# EasyEDA Pro project 搞机小队_v1.1.3.eprj, schematic 主控
Board Name: 主控; Create Date: 2025-09-06; Page Name: P1; Project Name: 搞机小队_v1.1.3; Schematic Name: 主控; Update Date: 2025-10-30; Company: 嘉立创EDA; Page Size: A4; Version: V1.0
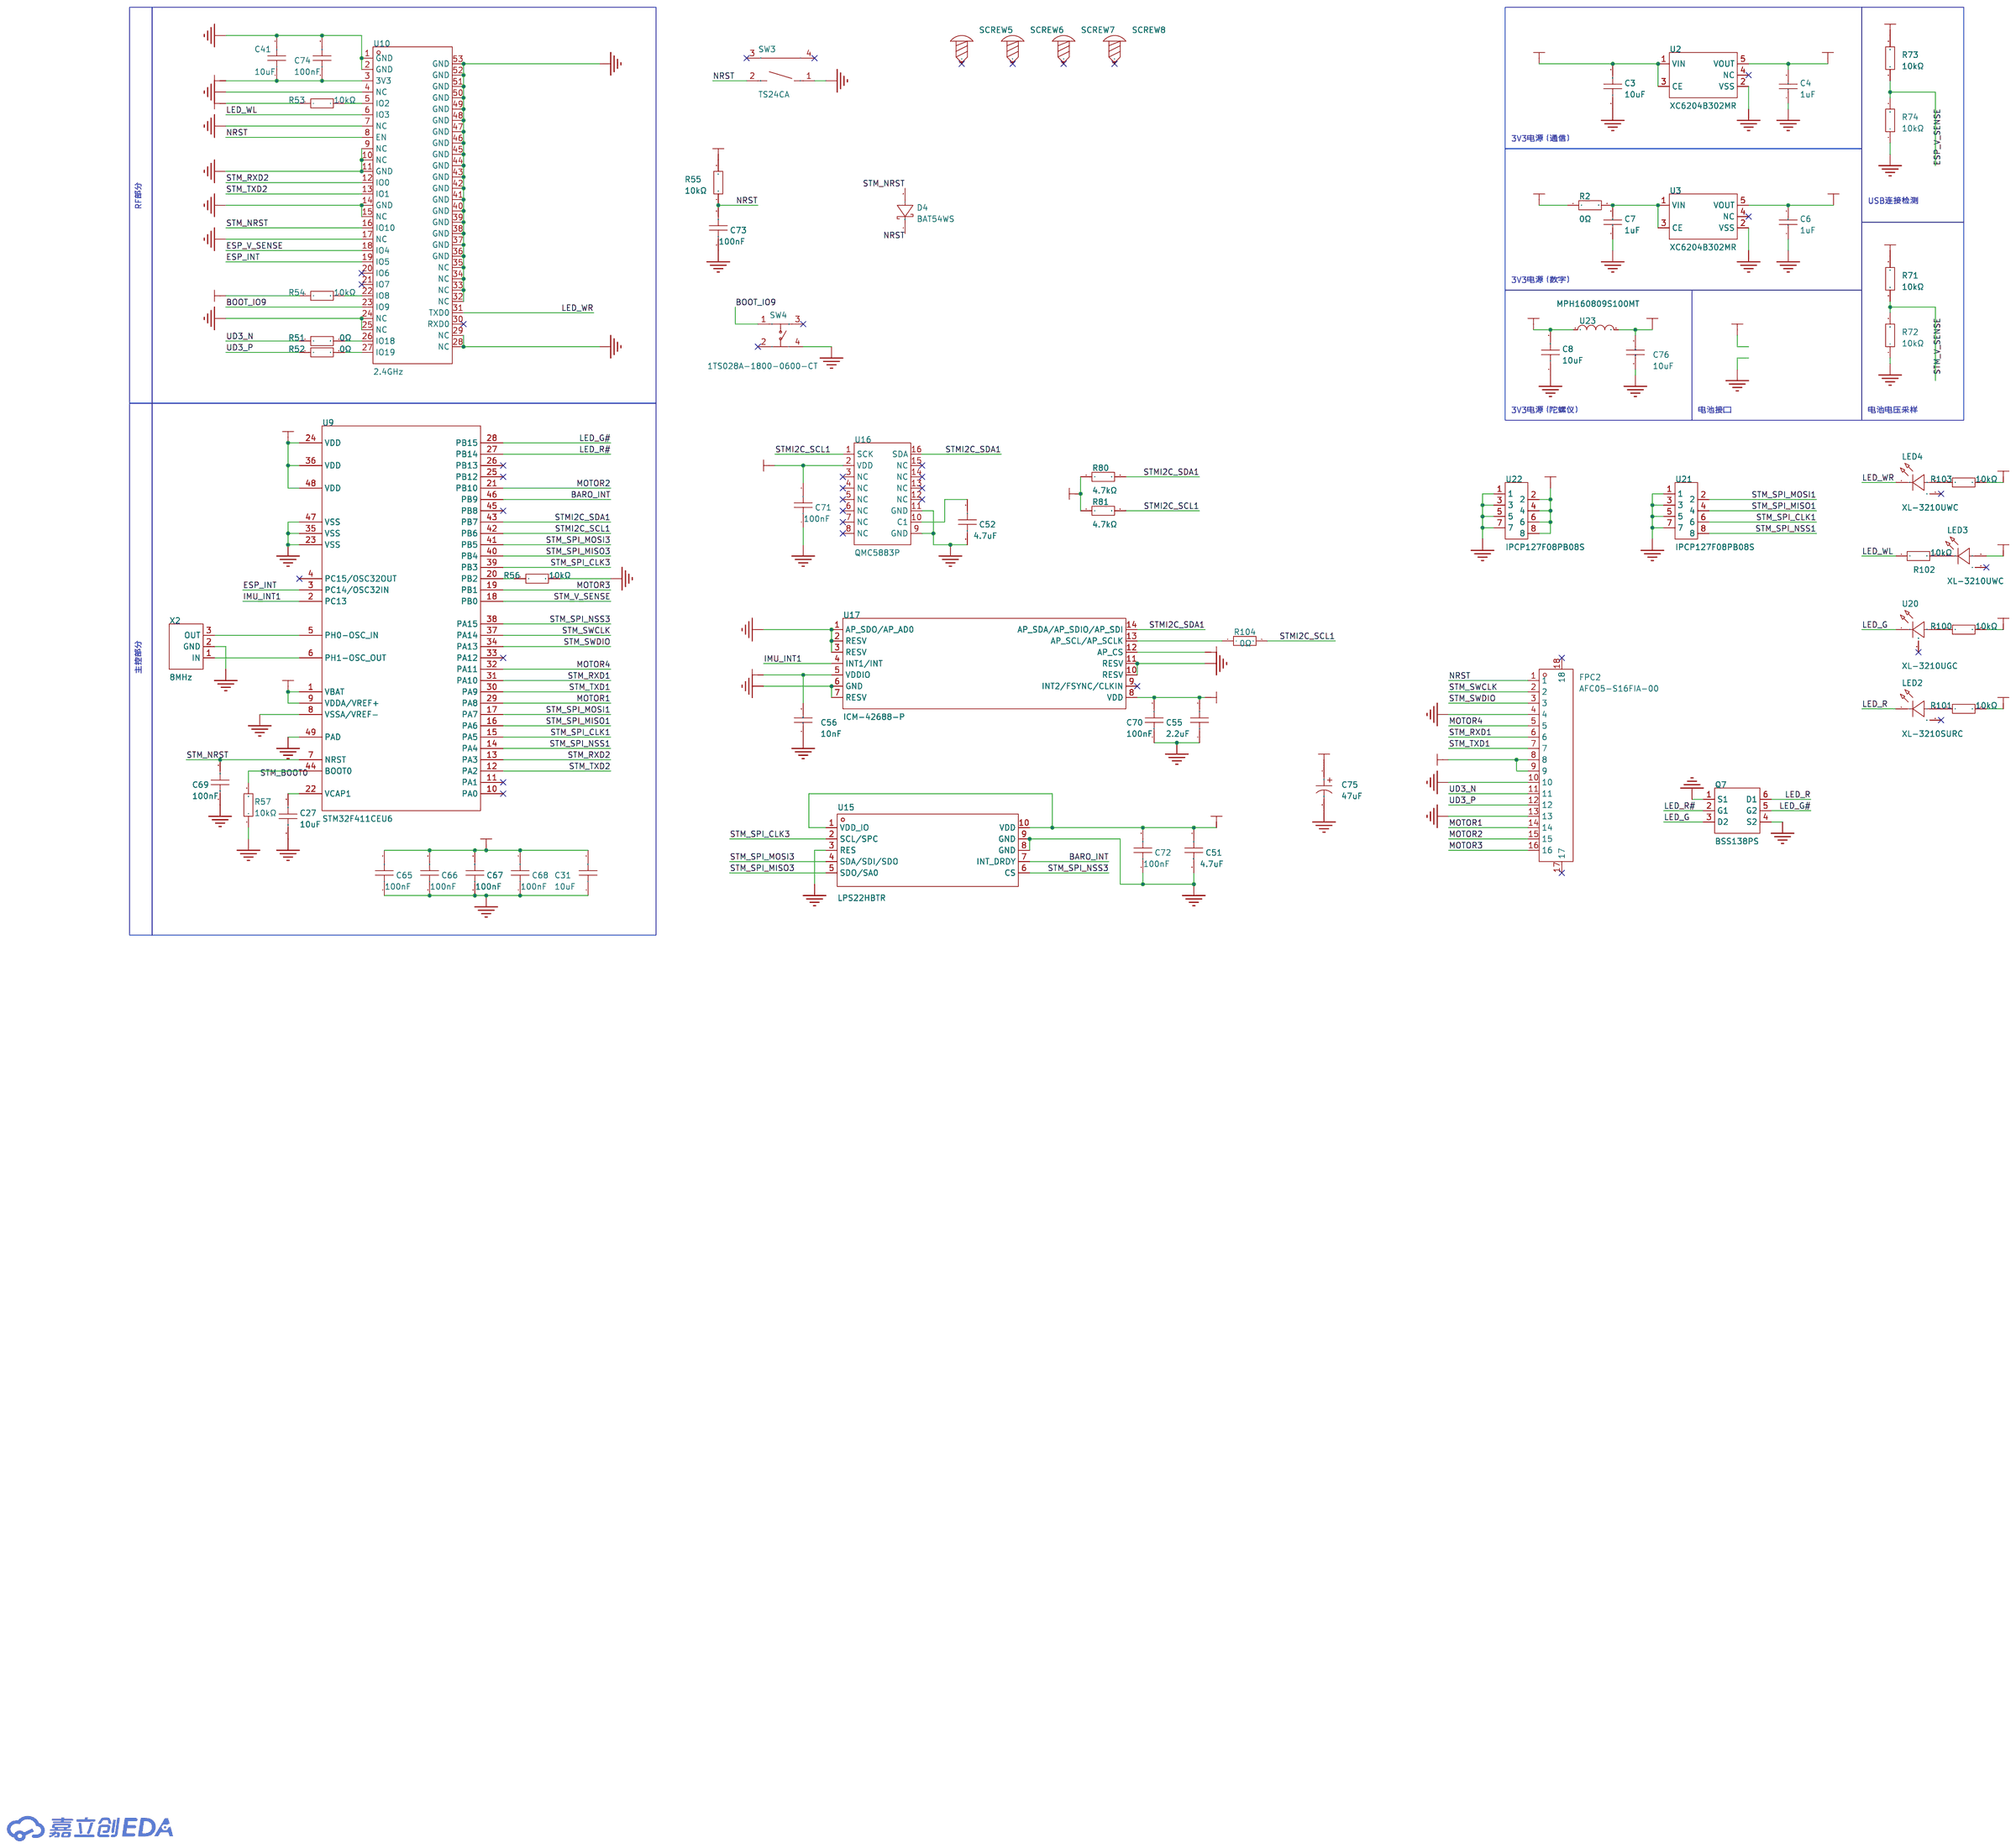
[diagram p0: schematic sheet]

## Parts
C3  10uF  [C0603]
C4  1uF  [C0603]
C6  1uF  [C0603]
C7  1uF  [C0603]
C8  10uF  [C0603]
C27  10uF  [C0603]
C31  10uF  [C0603]
C41  10uF  [C0603]
C51  4.7uF  [C0603]
C52  4.7uF  [C0603]
C55  2.2uF  [C0603]
C56  10nF  [C0603]
C65  100nF  [C0402]
C66  100nF  [C0402]
C67  100nF  [C0402]
C68  100nF  [C0402]
C69  100nF  [C0402]
C70  100nF  [C0402]
C71  100nF  [C0402]
C72  100nF  [C0402]
C73  100nF  [C0402]
C74  100nF  [C0402]
C75  47uF  [CAP-SMD_L3.2-W1.6]
C76  10uF  [C0603]
D4  BAT54WS  [SOD-323_L1.7-W1.3-LS2.6-RD]
FPC2  AFC05-S16FIA-00  [FPC-SMD_16P-P0.50_AFC05-S16FIA-00]
LED2  XL-3210SURC  [LED-SMD_3P-L3.2-W1.5-RD_EH-S110KGKT]
LED3  XL-3210UWC  [LED-SMD_3P-L3.2-W1.5-RD_ORANGE]
LED4  XL-3210UWC  [LED-SMD_3P-L3.2-W1.5-RD_ORANGE]
Q7  BSS138PS  [SOT-363_L2.1-W1.3-P0.65-LS2.3-BL]
R2  0Ω  [R0805]
R51  0Ω  [R0402]
R52  0Ω  [R0402]
R53  10kΩ  [R0402]
R54  10kΩ  [R0402]
R55  10kΩ  [R0402]
R56  10kΩ  [R0402]
R57  10kΩ  [R0402]
R71  10kΩ  [R0402]
R72  10kΩ  [R0402]
R73  10kΩ  [R0402]
R74  10kΩ  [R0402]
R80  4.7kΩ  [R0402]
R81  4.7kΩ  [R0402]
R100  10kΩ  [R0402]
R101  10kΩ  [R0402]
R102  10kΩ  [R0402]
R103  10kΩ  [R0402]
R104  0Ω  [R0603]
SCREW5  -  [M3螺丝]
SCREW6  -  [M3螺丝]
SCREW7  -  [M3螺丝]
SCREW8  -  [M3螺丝]
SW3  TS24CA  [SW-SMD_2P-TS24CA]
SW4  1TS028A-1800-0600-CT  [SW-SMD_4P-L2.8-W1.9-P1.20-LS3.0_1TS028A]
U2  XC6204B302MR  [SOT-23-5_L3.0-W1.7-P0.95-LS2.8-BL]
U3  XC6204B302MR  [SOT-23-5_L3.0-W1.7-P0.95-LS2.8-BL]
U9  STM32F411CEU6  [UFQFPN-48_L7.0-W7.0-P0.50-BL-EP]
U10  2.4GHz  [WIFIM-SMD_ESP32-C3-MINI-1]
U15  LPS22HBTR  [HLGA-10L_LPS22HBTR]
U16  QMC5883P  [LGA-16_L3.0-W3.0-P0.50-BL_SQ]
U17  ICM-42688-P  [LGA-14_L3.0-W2.5-P0.50-TL]
U20  XL-3210UGC  [LED-SMD_3P-L3.2-W1.5-RD_GREEN]
U21  IPCP127F08PB08S  [HDR-SMD_IPCP127F08PB08S]
U22  IPCP127F08PB08S  [HDR-SMD_IPCP127F08PB08S]
U23  MPH160809S100MT  [L0603]
X2  8MHz  [OSC-SMD_3P-L3.2-W1.3-P1.20]

## Library data of the parts
C3 C8 C27 C31 C41 = CC0603KRX5R6BB106: 容值:10uF;精度:±10%;额定电压:10V;材质(温度系数):X5R;; LCSC Part Name: 10uF ±10% 10V; Supplier Part: C326057; Manufacturer: YAGEO(国巨); Supplier Footprint: 0603; JLCPCB Part Class: 扩展库; Datasheet: https://atta.szlcsc.com/upload/public/pdf/source/20181031/C326057_4190003E428C5A97DF6434D0EAB53BEA.pdf; Supplier: LCSC; Tolerance: ±10%; Voltage Rated: 10V; Temperature Coefficient: X5R
C4 C6 C7 = CC0603KRX7R9BB105: 容值:1uF;精度:±10%;额定电压:50V;温度系数:X7R;; LCSC Part Name: 1uF ±10% 50V; Supplier Part: C559769; Manufacturer: YAGEO(国巨); Supplier Footprint: 0603; JLCPCB Part Class: Extended Part; Datasheet: https://item.szlcsc.com/datasheet/CC0603KRX7R9BB105/584032.html; Supplier: LCSC; Tolerance: ±10%; Voltage Rating: 50V; Temperature Coefficient: X7R
C51 C52 = CC0603KRX5R7BB475: 容值:4.7uF;精度:±10%;额定电压:16V;材质(温度系数):X5R;; LCSC Part Name: 4.7uF ±10% 16V; Supplier Part: C277476; Manufacturer: YAGEO(国巨); Supplier Footprint: 0603; JLCPCB Part Class: 扩展库; Datasheet: https://atta.szlcsc.com/upload/public/pdf/source/20240708/74D7CC2672B7CD71C30ED4CACAE97037.pdf; Supplier: LCSC; Tolerance: ±10%; Voltage Rated: 16V; Temperature Coefficient: X5R
C55 = CC0603KRX7R7BB225: 容值:2.2uF;精度:±10%;额定电压:16V;材质(温度系数):X7R;; LCSC Part Name: 2.2uF ±10% 16V; Supplier Part: C914769; Manufacturer: YAGEO(国巨); Supplier Footprint: 0603; Datasheet: https://atta.szlcsc.com/upload/public/pdf/source/20201217/C914769_172E140EC7E52AC241E5EC40E74BC1D4.pdf; Supplier: LCSC; Tolerance: ±10%; Voltage Rated: 16V; Temperature Coefficient: X7R
C56 = CC0603KRX7R9BB103: 容值:10nF;精度:±10%;额定电压:50V;材质(温度系数):X7R;; LCSC Part Name: 10nF ±10% 50V; Supplier Part: C100042; Manufacturer: YAGEO(国巨); Supplier Footprint: 0603; JLCPCB Part Class: 扩展库; Datasheet: https://atta.szlcsc.com/upload/public/pdf/source/20181008/C309510_22F155564471FAF6A489F7D68F34234E.pdf; Supplier: LCSC; Tolerance: ±10%; Voltage Rated: 50V; Temperature Coefficient: X7R
C65-C74 = CC0402KRX7R7BB104: 容值:100nF;精度:±10%;额定电压:16V;材质(温度系数):X7R;; LCSC Part Name: 100nF ±10% 16V; Supplier Part: C60474; Manufacturer: YAGEO(国巨); Supplier Footprint: 0402; Datasheet: https://atta.szlcsc.com/upload/public/pdf/source/20211223/9278FD768280B81DDBEF48FA36411A03.pdf; Supplier: LCSC; Tolerance: ±10%; Voltage Rated: 16V; Temperature Coefficient: X7R
C75 = CA45-A-10V-47uF-M: LCSC Part Name: 47uF ±20% 10V; Supplier Part: C688949; Manufacturer: CEC(振华新云); Supplier Footprint: CASE-A-3216; Datasheet: https://atta.szlcsc.com/upload/public/pdf/source/20200701/C688947_CFA6E56082A981E438B337581FD21AD9.pdf; Supplier: LCSC; Tolerance: ±20%; Rated Voltage: 10V; Equivalent Series Resistance(ESR): 4Ω@100kHz; Operating Temperature: -55℃~+125℃
C76 = CC0603MRX5R7BB106: LCSC Part Name: 10uF ±20% 16V; Supplier Part: C109457; Manufacturer: YAGEO(国巨); Supplier Footprint: 0603; JLCPCB Part Class: 扩展库; Datasheet: https://item.szlcsc.com/datasheet/CC0603MRX5R7BB106/110678.html; Supplier: LCSC; Tolerance: ±20%; Voltage Rating: 16V; Temperature Coefficient: X5R
D4 = BAT54WS_C5766570: 这款肖特基二极管具有0.2A的额定电流和30V的最大电压，其低正向压降仅为0.8V，在轻负载条件下反向电流低至2µA。该二极管能够承受高达0.6A的瞬态浪涌电流，适用于各种便携式电子产品中的高效整流或保护电路，确保设备稳定运行的同时减少能量损耗。(BAT54WS-7-F); LCSC Part Name: IF:0.2A VR:30V VF:0.8V IFSM:0.6A; Supplier Part: C5766570; Manufacturer: HXY MOSFET(华轩阳电子); Supplier Footprint: SOD-323; JLCPCB Part Class: 扩展库; Datasheet: https://atta.szlcsc.com/upload/public/pdf/source/20240930/6373992D0165080641439F83871EFB7A.pdf; Supplier: LCSC
FPC2 = AFC05-S16FIA-00: 锁定特性:翻盖式;触点类型:下接;触点数量:16P;间距:0.5mm;安装方式:卧贴;; LCSC Part Name: 间距:0.5mm P数:16P 翻盖式 下接; Supplier Part: C561388; Manufacturer: JS(钜硕电子); Supplier Footprint: SMD,P=0.5mm,卧贴; Datasheet: https://item.szlcsc.com/datasheet/AFC05-S16FIA-00/586775.html; Supplier: LCSC; Locking Feature: 翻盖式; Contact Type: 下接; Number of Contacts: 16P; Pitch: 0.5mm; Mounting Type: 卧贴; FFC, FCB Thickness: 0.3mm; Height Above Board: 1mm
LED2 = XL-3210SURC: LCSC Part Name: 贴片式发光二极管; Supplier Part: C965874; Manufacturer: XINGLIGHT(成兴光); Supplier Footprint: SMD,3.2x1.5mm; JLCPCB Part Class: Extended Part; Datasheet: https://item.szlcsc.com/datasheet/XL-3210SURC/1051483.html; Supplier: LCSC; Illumination Color: 红色; Voltage - Forward(Vf): 2.4V; Power(Watts): 50mW; Forward Current: 20mA; Wavelength - Dominant: 615nm~630nm; Peak Wavelength: 625nm; Lens Color: 无色透明透镜; Luminous Intensity: 300mcd; Viewing Angle: 120°; Mounting Style: 侧贴
LED3 LED4 = XL-3210UWC: 灯头类型:-;发光颜色:白色;正向压降(Vf):3.4V;功率:70mW;正向电流:20mA;波长:-;二极管配置:-;透镜颜色:黄色透镜;色温:-;发光强度:1100mcd;发光角度:120°;载带方式:侧贴;工作温度:-;; Supplier Part: C965880; Manufacturer: XINGLIGHT(成兴光); Supplier Footprint: SMD,1.5x3.2mm; JLCPCB Part Class: 扩展库; Datasheet: https://item.szlcsc.com/datasheet/XL-3210UWC/1051489.html; Supplier: LCSC; Illumination Color: 白色; Voltage - Forward(Vf): 3.4V; Power(Watts): 70mW; Forward Current: 20mA; Lens Color: 黄色透镜; Luminous Intensity: 1100mcd; Viewing Angle: 120°; Mounting Style: 侧贴
Q7 = BSS138PS_C5224289: 数量:2个N沟道;漏源电压(Vdss):60V;连续漏极电流(Id):410mA;导通电阻(RDS(on)):1.5Ω@10V；1.6Ω@4.5V;耗散功率(Pd):417mW;阈值电压(Vgs(th)):1V@250uA;; LCSC Part Name: 2个N沟道 耐压:60V 电流:410mA; Supplier Part: C5224289; Manufacturer: ElecSuper(静芯); Supplier Footprint: SOT-363; Datasheet: https://item.szlcsc.com/datasheet/BSS138PS/5925798.html; Supplier: LCSC; Number: 2个N沟道; Drain to Source Voltage: 60V; Current - Continuous Drain(Id): 410mA; RDS(on): 1.5Ω@10V；1.6Ω@4.5V; Pd - Power Dissipation: 417mW; Gate Threshold Voltage (Vgs(th)): 1V@250uA; Gate Charge(Qg): 650pC@4.5V; Input Capacitance(Ciss): 25pF; Reverse Transfer Capacitance (Crss@Vds): 2.2pF; Operating Temperature: -50℃~+150℃; Type: N沟道; Output Capacitance(Coss): 9.7pF
R2 = 0805W8F0000T5E: 电阻类型:厚膜电阻;阻值:0Ω;精度:±1%;功率:125mW;最大工作电压:150V;温度系数:±800ppm/℃;; LCSC Part Name: 0Ω ±1% 125mW 厚膜电阻; Supplier Part: C17477; Manufacturer: UNI-ROYAL(厚声); Supplier Footprint: 0805; Datasheet: https://atta.szlcsc.com/upload/public/pdf/source/20200306/C422600_1E6D84923E4A46A82E41ADD87F860B5C.pdf; Supplier: LCSC; Type: 厚膜电阻; Tolerance: ±1%; Power(Watts): 125mW; Overload Voltage (Max): 150V; Temperature Coefficient: ±800ppm/℃; Operating Temperature Range: -55℃~+155℃
R51 R52 = 0402WGF0000TCE: 电阻类型:厚膜电阻;阻值:0Ω;精度:±1%;功率:62.5mW;工作电压:50V;温度系数:±800ppm/℃;; LCSC Part Name: 0Ω ±1% 62.5mW 厚膜电阻; Supplier Part: C17168; Manufacturer: UNI-ROYAL(厚声); Supplier Footprint: 0402; JLCPCB Part Class: 基础库; Datasheet: https://item.szlcsc.com/datasheet/0402WGF0000TCE/17853.html; Supplier: LCSC; Type: 厚膜电阻; Tolerance: ±1%; Power(Watts): 62.5mW; Voltage-Supply(Max): 50V; Temperature Coefficient: ±800ppm/℃; Operating Temperature: -55℃~+155℃
R53-R57 R71-R74 R100-R103 = 0402WGF1002TCE: 电阻类型:厚膜电阻;阻值:10kΩ;精度:±1%;功率:62.5mW;工作电压:50V;温度系数:±100ppm/℃;; LCSC Part Name: 10kΩ ±1% 62.5mW 厚膜电阻; Supplier Part: C25744; Manufacturer: UNI-ROYAL(厚声); Supplier Footprint: 0402; JLCPCB Part Class: 基础库; Datasheet: https://item.szlcsc.com/datasheet/0402WGF1002TCE/26487.html; Supplier: LCSC; Type: 厚膜电阻; Tolerance: ±1%; Power(Watts): 62.5mW; Voltage-Supply(Max): 50V; Temperature Coefficient: ±100ppm/℃; Operating Temperature: -55℃~+155℃
R80 R81 = 0402WGF4701TCE: 电阻类型:厚膜电阻;阻值:4.7kΩ;精度:±1%;功率:62.5mW;工作电压:50V;温度系数:±100ppm/℃;; LCSC Part Name: 4.7kΩ ±1% 62.5mW 厚膜电阻; Supplier Part: C25900; Manufacturer: UNI-ROYAL(厚声); Supplier Footprint: 0402; JLCPCB Part Class: 基础库; Datasheet: https://item.szlcsc.com/datasheet/0402WGF4701TCE/26643.html; Supplier: LCSC; Type: 厚膜电阻; Tolerance: ±1%; Power(Watts): 62.5mW; Voltage-Supply(Max): 50V; Temperature Coefficient: ±100ppm/℃; Operating Temperature: -55℃~+155℃
R104 = 0603WAF0000T5E: 电阻类型:厚膜电阻;阻值:0Ω;精度:±1%;功率:100mW;工作电压:75V;温度系数:-;; LCSC Part Name: 0Ω ±1% 100mW 厚膜电阻; Supplier Part: C21189; Manufacturer: UNI-ROYAL(厚声); Supplier Footprint: 0603; Datasheet: https://item.szlcsc.com/datasheet/0603WAF0000T5E/21903.html; Supplier: LCSC; Type: 厚膜电阻; Tolerance: ±1%; Power(Watts): 100mW; Voltage-Supply(Max): 75V; Operating Temperature: -55℃~+155℃
SCREW5-SCREW8 = M3螺丝: Supplier Footprint: 插件; Check: false
SW3 = TS24CA: 电路结构:单刀单掷;按钮形状:矩形按钮;安装方式:卧贴;开关长度:4.55mm;开关宽度:1.8mm;开关高度:3.5mm;触点电流:50mA;额定电压:12V;带灯:-;工作寿命:-;; LCSC Part Name: 4.55*1.8*3.5mm 卧贴 轻触开关; Supplier Part: C393942; Manufacturer: SHOU HAN(首韩); Supplier Footprint: SMD; JLCPCB Part Class: 扩展库; Datasheet: https://item.szlcsc.com/datasheet/TS24CA/372554.html; Supplier: LCSC; Circuit: 单刀单掷; Actuator Style: 矩形按钮; Mounting Type: 卧贴; Length: 4.55mm; Width: 1.8mm; Switch Height: 3.5mm; Contact Current: 50mA; Voltage Rating: 12V
SW4 = 1TS028A-1800-0600-CT: 电路结构:单刀单掷;按钮形状:圆形按钮;作用力:180gf;安装方式:立贴;开关长度:2.8mm;开关宽度:1.9mm;开关高度:0.6mm;带支架:不带;触点电流:50mA;额定电压(DC):12V;额定功率:0.6W;绝缘电阻:100MΩ;带灯:无;机械寿命:30万次;; LCSC Part Name: 2.8*1.9*0.6mm 立贴 轻触开关; Supplier Part: C481988; Manufacturer: HYP(鸿源精密); Supplier Footprint: SMD,1.9x2.8mm; JLCPCB Part Class: 扩展库; Datasheet: https://atta.szlcsc.com/upload/public/pdf/source/20200113/C481988_727CCA1D3584FEA5100570402D465BF6.pdf; Supplier: LCSC; Circuit: 单刀单掷; Actuator Style: 圆形按钮; Operating Force: 180gf; Mounting Style: 立贴; Switch Length: 2.8mm; Switch Width: 1.9mm; Switch Height: 0.6mm; Strike Gundam: 不带; Contact Current: 50mA; Voltage Rating (DC): 12V; Power Rating: 0.6W; Insulation Resistance: 100MΩ; Actuator/Cap Color: 黑色; With Lamp: 无; IP Rating: IP68; Pin Style: SMD接片; Mechanical Life: 30万次; Operating Temperature: -40℃~+90℃
U2 U3 = XC6204B302MR: 输出类型:固定;工作电压:24V;输出电压:3V;输出电流:300mA;电源纹波抑制比(PSRR):-;输出极性:正极;; Supplier Part: C18212678; Manufacturer: TECH PUBLIC(台舟); Supplier Footprint: SOT-23-5; JLCPCB Part Class: 扩展库; Datasheet: https://atta.szlcsc.com/upload/public/pdf/source/20231024/3932E471DEDBF94F2F854F1C0B7D03E0.pdf; Supplier: LCSC; Output Type: 固定; Voltage - Supply: 24V; Output Voltage: 3V; Output Current: 300mA; Features: 过流保护；过热保护; Operating Temperature: -40℃~+125℃@(Tj); Output Configuration: 正极; Number of Outputs: 1
U9 = STM32F411CEU6: CPU内核:ARM-M4;CPU最大主频:100MHz;应用领域:-;; LCSC Part Name: 带DSP和FPU的高性能基本型系列ARM Cortex-M4 MCU，具有512 KB Flash、100 MHz CPU和ART加速器; Supplier Part: C60420; Manufacturer: ST(意法半导体); Supplier Footprint: UFQFPN-48(7x7); Datasheet: https://atta.szlcsc.com/upload/public/pdf/source/20151026/1457707507170.pdf; Supplier: LCSC; CPU Core: ARM-M4; CPU Maximum Speed: 100MHz; Program Storage Size: 512KB; Program Memory Type: FLASH; Number of I/O: 36; ADC (Bit): 12bit; Voltage - Supply: 1.7V~3.6V
U10 = ESP32-C3-MINI-1-H4: 核心处理器:-;频率:2.4GHz;天线形式:板载PCB天线;发射功率:20.5dBm;接收灵敏度:-96dBm;; Supplier Part: C2934569; Manufacturer: ESPRESSIF(乐鑫); Supplier Footprint: SMD,13.2x16.6mm; JLCPCB Part Class: 扩展库; Datasheet: https://atta.szlcsc.com/upload/public/pdf/source/20211222/4A6E563D9536B67D492463D36DD57C1D.pdf; Supplier: LCSC; Support Interface: SPI; Antenna Type: 板载PCB天线; Output Power: 20.5dBm; Operating Voltage: 3.3V; Sensitivity: -96dBm; Operating Temperature: -40℃~+85℃
U15 = LPS22HBTR: 压力范围:26Kpa~126Kpa;; Supplier Part: C94049; Manufacturer: ST(意法半导体); Supplier Footprint: HLGA-10(2x2); JLCPCB Part Class: 扩展库; Datasheet: https://atta.szlcsc.com/upload/public/pdf/source/20170908/C94049_1504870171328958154.pdf; Supplier: LCSC; Pressure range: 26Kpa~126Kpa; The Power Supply Voltage: 1.7V~3.6V; Operating Temperature: -40℃~+85℃
U16 = QMC5883P: QMC5883L停产，推荐使用 C2847467 QMC5883P替代; LCSC Part Name: 三轴磁传感器; Supplier Part: C2847467; Manufacturer: QST(上海矽睿); Supplier Footprint: LGA-16(3x3); JLCPCB Part Class: 扩展库; Datasheet: https://item.szlcsc.com/datasheet/QMC5883P/3044607.html; Supplier: LCSC
U17 = ICM-42688-P: 传感器类型:加速度计陀螺仪;; Supplier Part: C1850418; Manufacturer: TDK InvenSense(应美盛); Supplier Footprint: LGA-14(2.5x3); JLCPCB Part Class: 扩展库; Datasheet: https://atta.szlcsc.com/upload/public/pdf/source/20210703/CF24204867ACE5B754A2B035F23E5931.pdf; Supplier: LCSC; Sensor Type: 加速度计陀螺仪
U20 = XL-3210UGC: 发光颜色:翠绿色;功率:-;正向电流:-;波长:517.5nm~525nm;透镜颜色:无色透明透镜;色温:-;发光角度:120°;载带方式:侧贴;工作温度:-;; Supplier Part: C965877; Manufacturer: XINGLIGHT(成兴光); Supplier Footprint: SMD,1.5x3.2mm; Datasheet: https://item.szlcsc.com/datasheet/XL-3210UGC/1051486.html; Supplier: LCSC; Illumination Color: 翠绿色; Wavelength - Dominant: 517.5nm~525nm; Peak Wavelength: 535nm; Lens Color: 无色透明透镜; Viewing Angle: 120°; Mounting Style: 侧贴
U21 U22 = IPCP127F08PB08S: 插孔结构:1x8P;间距:1.27mm;圆孔/方孔:方孔;安装方式:立贴;排数:单排;总孔位数:8P;额定电流:1A;额定电压:-;塑高:2mm;触头材质:磷青铜;触头镀层:金;工作温度:-40℃~+105℃;; LCSC Part Name: 1x8P 间距:1.27mm 立贴; Supplier Part: C22438398; Manufacturer: INCP; Supplier Footprint: SMD,P=1.27mm(交错脚); Datasheet: https://item.szlcsc.com/datasheet/IPCP127F08PB08S/24076587.html; Supplier: LCSC; Holes Structure: 1x8P; Pitch: 1.27mm; Circular Hole / Square Hole: 方孔; Mounting Type: 立贴; Number of Rows: 单排; Number of Positions: 8P; Current Rating: 1A; Insulation Height: 2mm; Contact Material: 磷青铜; Contact Plating: 金; Operating Temperature: -40℃~+105℃
U23 = MPH160809S100MT: Supplier Part: C6807729; Manufacturer: Sunlord(顺络); Supplier Footprint: 0603; JLCPCB Part Class: 扩展库; Datasheet: https://atta.szlcsc.com/upload/public/pdf/source/20241120/D50FD5550E500CE51CF2F3A3AE14E46E.pdf; Supplier: LCSC
X2 = CSTNE8M00G520000R0: 频率:8MHz;内置负载电容:10pF;谐振阻抗:40Ω;; LCSC Part Name: 8MHz ±0.5% 内置负载电容:10pF; Supplier Part: C907975; Manufacturer: muRata(村田); Supplier Footprint: SMD3213-3P; JLCPCB Part Class: 扩展库; Datasheet: https://atta.szlcsc.com/upload/public/pdf/source/20201022/C907975_BE77A173E35C03920A12013DDB2B8858.pdf; Supplier: LCSC; Built-in Load Capacitance: 10pF; Resonant Impedance: 40Ω; Operating Temperature: -40℃~+85℃

## Nets
3V3_D: C6.2 C8.2 C31.2 C65.2 C66.2 C67.2 C68.2 U3.5(VOUT) U9.1(VBAT) U9.9(VDDA/VREF+) U9.24(VDD) U9.36(VDD) U9.48(VDD) U23.1
3V3_IMU: C51.1 C55.2 C56.2 C70.2 C71.2 C72.2 C76.2 R80.1 R81.1 U15.1(VDD_IO) U15.10(VDD) U16.2(VDD) U17.5(VDDIO) U17.8(VDD) U17.12(AP_CS) U23.2
3V3_RF: C4.2 C41.1 C74.1 LED3.2(A) R53.1 R54.1 R55.2 R103.2 U2.5(VOUT) U10.3(3V3)
GND: C3.1 C4.1 C6.1 C7.1 C8.1 C27.1 C31.1 C41.2 C51.2 C52.2 C55.1 C56.1 C65.1 C66.1 C67.1 C68.1 C69.1 C70.1 C71.1 C72.1 C73.1 C74.2 C75.2 C76.1 FPC2.4 FPC2.10 FPC2.13 Q7.1(S1) Q7.4(S2) R56.2 R57.1 R72.1 R74.1 SW3.1 SW4.4 U2.2(VSS) U3.2(VSS) U9.8(VSSA/VREF-) U9.23(VSS) U9.35(VSS) U9.47(VSS) U9.49(PAD) U10.1(GND) U10.2(GND) U10.4(NC) U10.7(NC) U10.9(NC) U10.10(NC) U10.11(GND) U10.14(GND) U10.15(NC) U10.17(NC) U10.24(NC) U10.25(NC) U10.28(NC) U10.29(NC) U10.32(NC) U10.33(NC) U10.34(NC) U10.35(NC) U10.36(GND) U10.37(GND) U10.38(GND) U10.39(GND) U10.40(GND) U10.41(GND) U10.42(GND) U10.43(GND) U10.44(GND) U10.45(GND) U10.46(GND) U10.47(GND) U10.48(GND) U10.49(GND) U10.50(GND) U10.51(GND) U10.52(GND) U10.53(GND) U15.3(RES) U15.8(GND) U15.9(GND) U16.9(GND) U16.11(GND) U17.1(AP_SDO/AP_AD0) U17.2(RESV) U17.3(RESV) U17.6(GND) U17.7(RESV) U17.10(RESV) U17.11(RESV) U21.1 U21.3 U21.5 U21.7 U22.1 U22.3 U22.5 U22.7 X2.2(GND)
BARO_INT: U9.46(PB9) U15.7(INT_DRDY)
BOOT_IO9: SW4.1 U10.23(IO9)
ESP_INT: U9.3(PC14/OSC32IN) U10.19(IO5)
ESP_V_SENSE: R73.1 R74.2 U10.18(IO4)
IMU_INT1: U9.2(PC13) U17.4(INT1/INT)
LED_G: Q7.3(D2) U20.1
LED_G#: Q7.5(G2) U9.28(PB15)
LED_R: LED2.1(-) Q7.6(D1)
LED_R#: Q7.2(G1) U9.27(PB14)
LED_WL: R102.1 U10.6(IO3)
LED_WR: LED4.1(K) U10.31(TXD0)
MOTOR1: FPC2.14 U9.29(PA8)
MOTOR2: FPC2.15 U9.21(PB10)
MOTOR3: FPC2.16 U9.19(PB1)
MOTOR4: FPC2.5 U9.32(PA11)
NRST: C73.2 D4.1(C) FPC2.1 R55.1 SW3.2 U10.8(EN)
POWER: C3.2 C75.1 FPC2.8 FPC2.9 R2.1 R71.2 R73.2 R100.2 R101.2 U2.1(VIN) U2.3(CE) U22.2 U22.4 U22.6 U22.8
STM_BOOT0: R57.2 U9.44(BOOT0)
STM_NRST: C69.2 D4.2(A) U9.7(NRST) U10.16(IO10)
STM_RXD1: FPC2.6 U9.31(PA10)
STM_RXD2: U9.13(PA3) U10.12(IO0)
STM_SPI_CLK1: U9.15(PA5) U21.6
STM_SPI_CLK3: U9.39(PB3) U15.2(SCL/SPC)
STM_SPI_MISO1: U9.16(PA6) U21.4
STM_SPI_MISO3: U9.40(PB4) U15.5(SDO/SA0)
STM_SPI_MOSI1: U9.17(PA7) U21.2
STM_SPI_MOSI3: U9.41(PB5) U15.4(SDA/SDI/SDO)
STM_SPI_NSS1: U9.14(PA4) U21.8
STM_SPI_NSS3: U9.38(PA15) U15.6(CS)
STM_SWCLK: FPC2.2 U9.37(PA14)
STM_SWDIO: FPC2.3 U9.34(PA13)
STM_TXD1: FPC2.7 U9.30(PA9)
STM_TXD2: U9.12(PA2) U10.13(IO1)
STM_V_SENSE: R71.1 R72.2 U9.18(PB0)
STMI2C_SCL1: R81.2 R104.2 U9.42(PB6) U16.1(SCK)
STMI2C_SDA1: R80.2 U9.43(PB7) U16.16(SDA) U17.14(AP_SDA/AP_SDIO/AP_SDI)
UD3_N: FPC2.11 R51.1
UD3_P: FPC2.12 R52.1
$1N7736: C7.2 R2.2 U3.1(VIN) U3.3(CE)
$1N7770: C27.2 U9.22(VCAP1)
$1N7798: U9.5(PH0-OSC_IN) X2.3(OUT)
$1N7799: U9.6(PH1-OSC_OUT) X2.1(IN)
$1N7801: R56.1 U9.20(PB2)
$1N11574: R53.2 U10.5(IO2)
$1N11654: R54.2 U10.22(IO8)
$1N15598: C52.1 U16.10(C1)
$1N42229: R104.1 U17.13(AP_SCL/AP_SCLK)
$1N52615: R51.2 U10.26(IO18)
$1N52617: R52.2 U10.27(IO19)
$1N93489: R100.1 U20.2
$1N93528: LED2.2(+) R101.1
$1N93606: LED4.2(A) R103.1
$1N93656: LED3.1(K) R102.2

Not connected (* = marked no-connect by the designer): FPC2 17* 18*; LED2 3(NC)*; LED3 3*; LED4 3*; SCREW5 1*; SCREW6 1*; SCREW7 1*; SCREW8 1*; SW3 3* 4*; SW4 2* 3*; U2 4(NC)*; U3 4(NC)*; U9 4(PC15/OSC32OUT)* 10(PA0)* 11(PA1)* 25(PB12)* 26(PB13)* 33(PA12)* 45(PB8)*; U10 20(IO6)* 21(IO7)* 30(RXD0)*; U16 3(NC)* 4(NC)* 5(NC)* 6(NC)* 7(NC)* 8(NC)* 12(NC)* 13(NC)* 14(NC)* 15(NC)*; U17 9(INT2/FSYNC/CLKIN)*; U20 3*

## Notes on the sheet
- 3V3电源（通信）
- RF部分
- USB连接检测
- 3V3电源（数字）
- 3V3电源（陀螺仪）
- 电池接口
- 电池电压采样
- 主控部分
